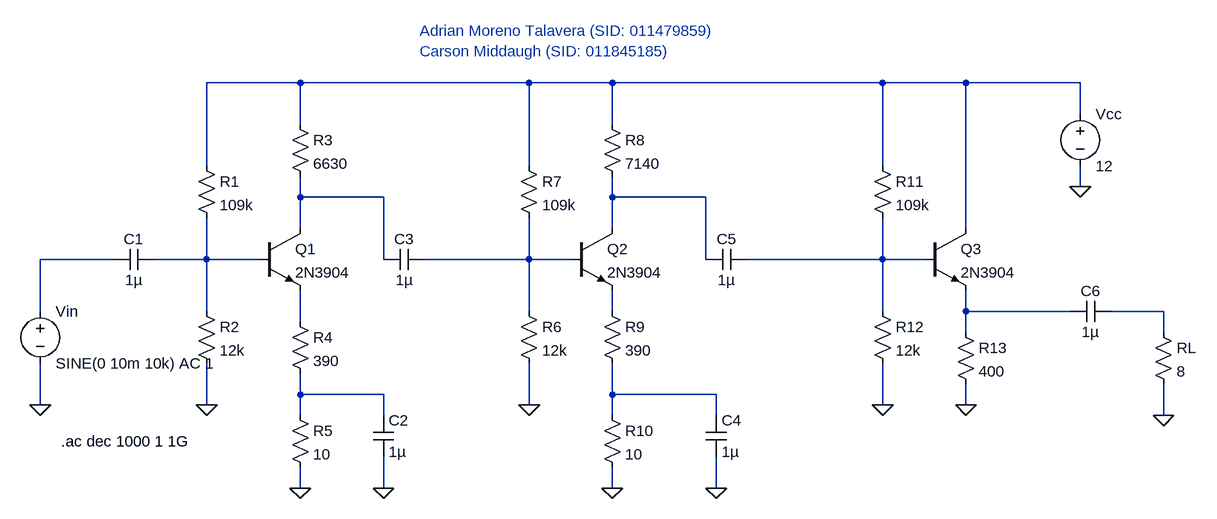
[diagram p0: schematic initial_calculated_design.asc]
initial_calculated_design.asc, the LTspice schematic file:
Version 4.1
SHEET 1 1524 680
WIRE 128 -96 -16 -96
WIRE 480 -96 128 -96
WIRE 608 -96 480 -96
WIRE 1024 -96 608 -96
WIRE 1152 -96 1024 -96
WIRE 1328 -96 1152 -96
WIRE 1328 -48 1328 -96
WIRE 128 -32 128 -96
WIRE 608 -32 608 -96
WIRE -16 32 -16 -96
WIRE 480 32 480 -96
WIRE 1024 32 1024 -96
WIRE 1328 64 1328 32
WIRE 128 80 128 48
WIRE 256 80 128 80
WIRE 608 80 608 48
WIRE 752 80 608 80
WIRE 128 128 128 80
WIRE 608 128 608 80
WIRE 1152 128 1152 -96
WIRE -160 176 -272 176
WIRE -16 176 -16 112
WIRE -16 176 -96 176
WIRE 64 176 -16 176
WIRE 256 176 256 80
WIRE 480 176 480 112
WIRE 480 176 320 176
WIRE 544 176 480 176
WIRE 752 176 752 80
WIRE 1024 176 1024 112
WIRE 1024 176 816 176
WIRE 1088 176 1024 176
WIRE -272 256 -272 176
WIRE -16 256 -16 176
WIRE 480 256 480 176
WIRE 608 256 608 224
WIRE 1024 256 1024 176
WIRE 1152 256 1152 224
WIRE 1312 256 1152 256
WIRE 1456 256 1376 256
WIRE 128 272 128 224
WIRE 1152 288 1152 256
WIRE 1456 288 1456 256
WIRE 128 384 128 352
WIRE 256 384 128 384
WIRE 608 384 608 336
WIRE 768 384 608 384
WIRE -272 400 -272 336
WIRE -16 400 -16 336
WIRE 480 400 480 336
WIRE 1024 400 1024 336
WIRE 1152 400 1152 368
WIRE 128 416 128 384
WIRE 256 416 256 384
WIRE 608 416 608 384
WIRE 768 416 768 384
WIRE 1456 416 1456 368
WIRE 128 528 128 496
WIRE 256 528 256 480
WIRE 608 528 608 496
WIRE 768 528 768 480
FLAG -272 400 0
FLAG -16 400 0
FLAG 128 528 0
FLAG 256 528 0
FLAG 480 400 0
FLAG 608 528 0
FLAG 768 528 0
FLAG 1024 400 0
FLAG 1152 400 0
FLAG 1456 416 0
FLAG 1328 64 0
SYMBOL npn 64 128 R0
SYMATTR InstName Q1
SYMATTR Value 2N3904
SYMBOL npn 544 128 R0
SYMATTR InstName Q2
SYMATTR Value 2N3904
SYMBOL npn 1088 128 R0
SYMATTR InstName Q3
SYMATTR Value 2N3904
SYMBOL voltage -272 240 R0
WINDOW 123 0 0 Left 0
WINDOW 39 0 0 Left 0
SYMATTR InstName Vin
SYMATTR Value SINE(0 10m 10k) AC 1
SYMBOL cap -96 160 R90
WINDOW 0 0 32 VBottom 2
WINDOW 3 32 32 VTop 2
SYMATTR InstName C1
SYMATTR Value 1µ
SYMBOL res -32 16 R0
SYMATTR InstName R1
SYMATTR Value 109k
SYMBOL res -32 240 R0
SYMATTR InstName R2
SYMATTR Value 12k
SYMBOL res 112 -48 R0
SYMATTR InstName R3
SYMATTR Value 6630
SYMBOL res 112 256 R0
SYMATTR InstName R4
SYMATTR Value 390
SYMBOL res 112 400 R0
SYMATTR InstName R5
SYMATTR Value 10
SYMBOL cap 240 416 R0
SYMATTR InstName C2
SYMATTR Value 1µ
SYMBOL cap 320 160 R90
WINDOW 0 0 32 VBottom 2
WINDOW 3 32 32 VTop 2
SYMATTR InstName C3
SYMATTR Value 1µ
SYMBOL res 464 240 R0
SYMATTR InstName R6
SYMATTR Value 12k
SYMBOL res 464 16 R0
SYMATTR InstName R7
SYMATTR Value 109k
SYMBOL res 592 -48 R0
SYMATTR InstName R8
SYMATTR Value 7140
SYMBOL res 592 240 R0
SYMATTR InstName R9
SYMATTR Value 390
SYMBOL res 592 400 R0
SYMATTR InstName R10
SYMATTR Value 10
SYMBOL cap 752 416 R0
SYMATTR InstName C4
SYMATTR Value 1µ
SYMBOL cap 816 160 R90
WINDOW 0 0 32 VBottom 2
WINDOW 3 32 32 VTop 2
SYMATTR InstName C5
SYMATTR Value 1µ
SYMBOL res 1008 16 R0
SYMATTR InstName R11
SYMATTR Value 109k
SYMBOL res 1008 240 R0
SYMATTR InstName R12
SYMATTR Value 12k
SYMBOL res 1136 272 R0
SYMATTR InstName R13
SYMATTR Value 400
SYMBOL cap 1376 240 R90
WINDOW 0 0 32 VBottom 2
WINDOW 3 32 32 VTop 2
SYMATTR InstName C6
SYMATTR Value 1µ
SYMBOL res 1440 272 R0
SYMATTR InstName RL
SYMATTR Value 8
SYMBOL voltage 1328 -64 R0
SYMATTR InstName Vcc
SYMATTR Value 12
TEXT 312 -176 Left 2 ;Adrian Moreno Talavera (SID: 011479859)\nCarson Middaugh (SID: 011845185)
TEXT -240 456 Left 2 !.ac dec 1000 1 1G

The netlist it stands for:
* initial_calculated_design.asc
Q1 N002 N005 N011 0 2N3904
Q2 N003 N006 N008 0 2N3904
Q3 N001 N007 N009 0 2N3904
Vin N004 0 SINE(0 10m 10k) AC 1
C1 N005 N004 1µ
R1 N001 N005 109k
R2 N005 0 12k
R3 N001 N002 6630
R4 N011 N012 390
R5 N012 0 10
C2 N012 0 1µ
C3 N006 N002 1µ
R6 N006 0 12k
R7 N001 N006 109k
R8 N001 N003 7140
R9 N008 N013 390
R10 N013 0 10
C4 N013 0 1µ
C5 N007 N003 1µ
R11 N001 N007 109k
R12 N007 0 12k
R13 N009 0 400
C6 N010 N009 1µ
RL N010 0 8
Vcc N001 0 12
.model NPN NPN
.model PNP PNP
.lib standard.bjt
* Adrian Moreno Talavera (SID: 011479859)
* Carson Middaugh (SID: 011845185)
.ac dec 1000 1 1G
.backanno
.end